# EAGLE design TUEV071 (EAGLE 7.5.0)
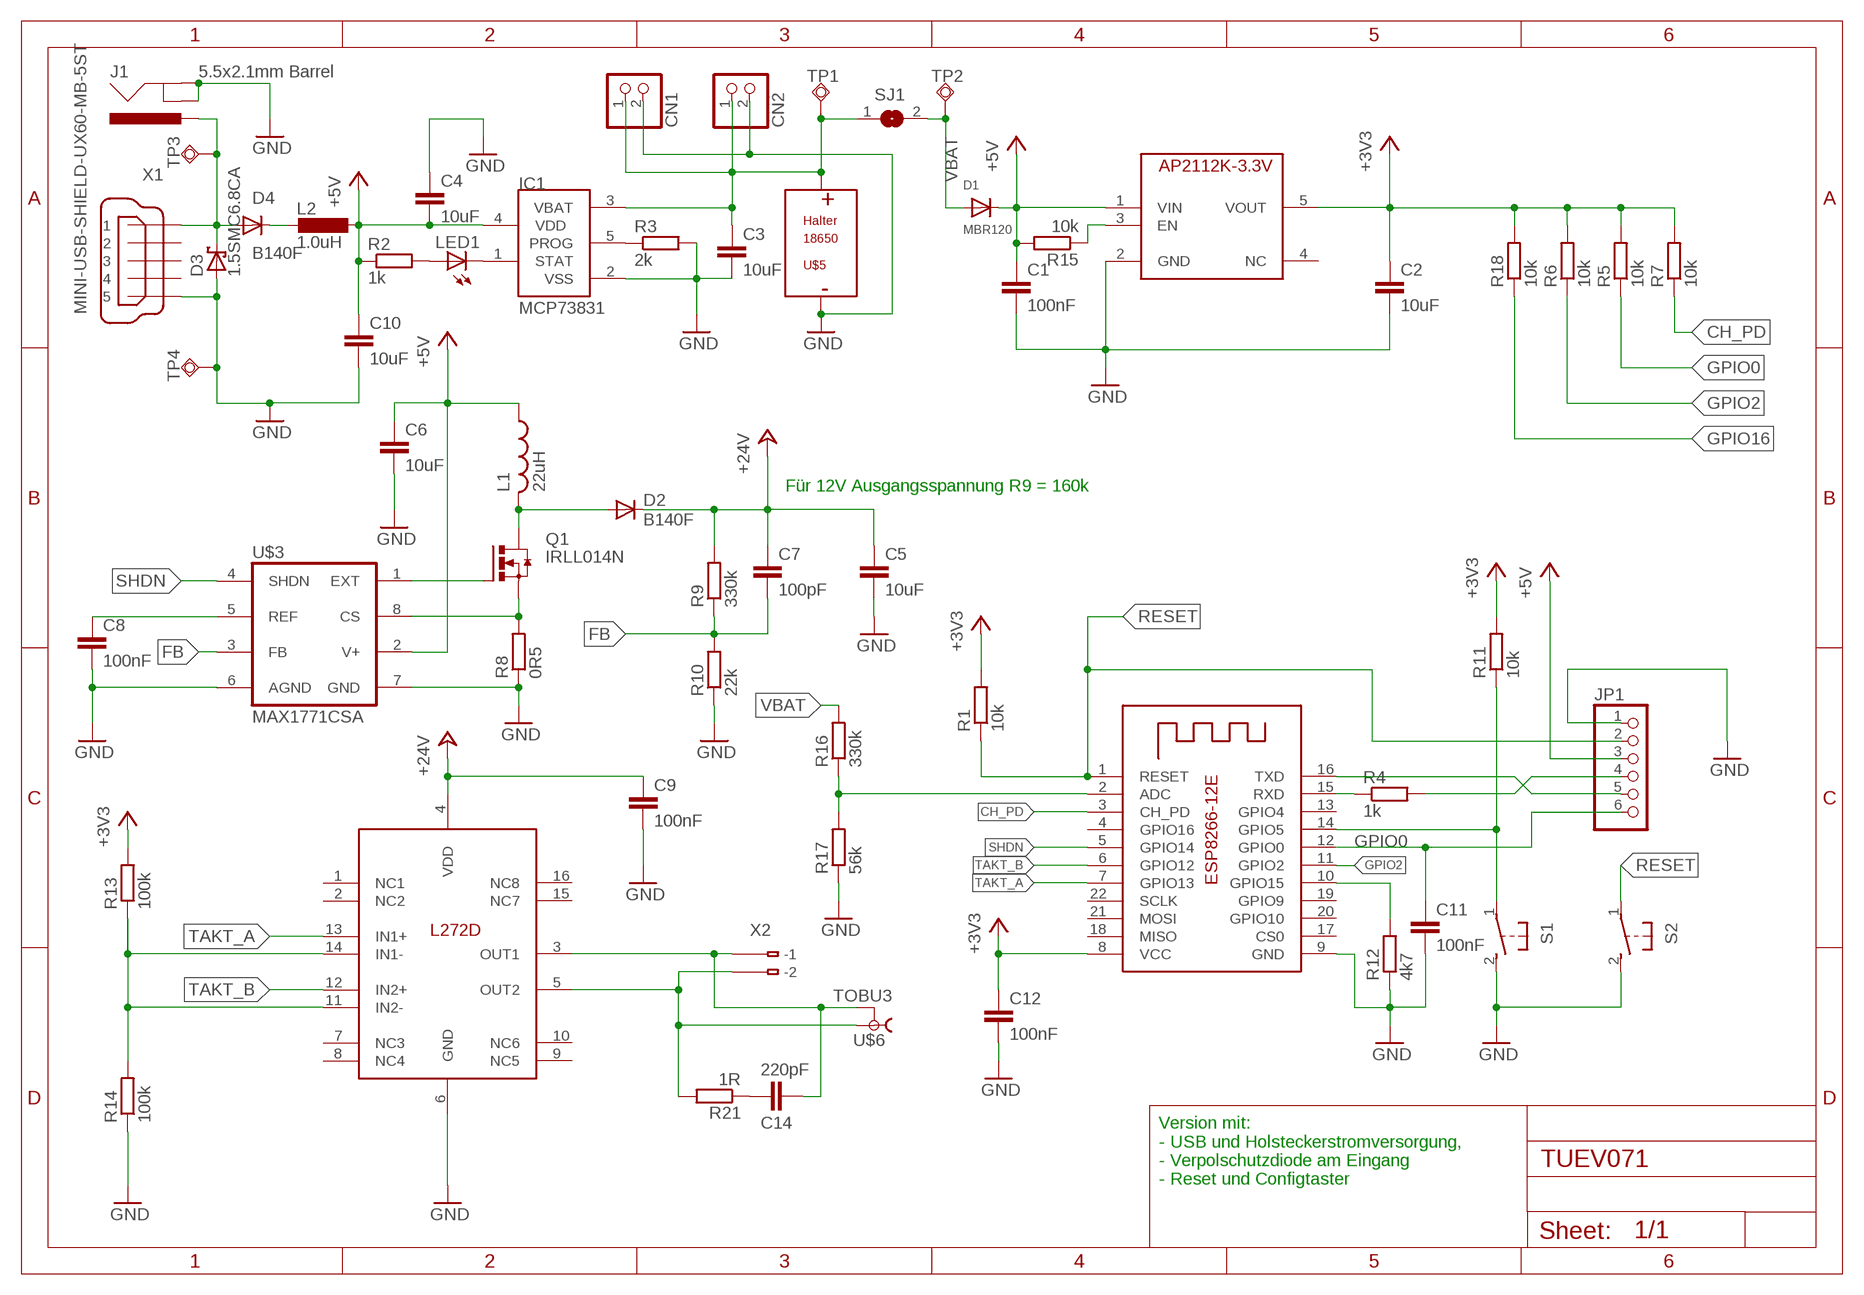
[diagram p0: schematic, sheet 1]

## Parts
C1  100nF  C-EUC0603K  [C0603K]
C2  10uF  C-EUC0603K  [C0603K]
C3  10uF  C-EUC0603K  [C0603K]
C4  10uF  C-EUC0603K  [C0603K]
C5  10uF  C-EUC1210K  [C1210K]
C6  10uF  C-EUC0603K  [C0603K]
C7  100pF  C-EUC0603K  [C0603K]
C8  100nF  C-EUC0603K  [C0603K]
C9  100nF  C-EUC0603K  [C0603K]
C10  10uF  C-EUC0603K  [C0603K]
C11  100nF  C-EUC0603K  [C0603K]
C12  100nF  C-EUC0603K  [C0603K]
C14  220pF  C-EUC0603K  [C0603K]
CN1  JST_2PIN-SMT-RA  [JST-PH-2-SMT-RA]
CN2  JST_2PIN-SMT-RA  [JST-PH-2-SMT-RA]
D1  MBR120  DIODESOD-123  [SOD-123]
D2  B140F  DIODE-DO214AC  [DO214AC]
D3  1.5SMC6.8CA  SCHOTTKY-DIODESMC  [SMC]
D4  B140F  DIODE-DO214AC  [DO214AC]
IC1  MCP73831  [SOT23-5L]
J1  5.5x2.1mm Barrel  POWER_JACKSMD  [POWER_JACK_SMD]
JP1  PINHD-1X6  [1X06]
L1  22uH  L-USL5650M  [L5650M]
L2  1.0uH  L-EUL3230M  [L3230M]
LED1  LEDCHIPLED_0805  [CHIPLED_0805]
Q1  IRLL014N  N-HEXFET-2D_SOT232-IRLL014N  [SOT223]
R1  10k  R-EU_M1206  [M1206]
R2  1k  R-EU_M1206  [M1206]
R3  2k  R-EU_M1206  [M1206]
R4  1k  R-EU_M1206  [M1206]
R5  10k  R-EU_M1206  [M1206]
R6  10k  R-EU_M1206  [M1206]
R7  10k  R-EU_M1206  [M1206]
R8  0R5  R-EU_R2512  [R2512]
R9  330k  R-EU_M1206  [M1206]
R10  22k  R-EU_M1206  [M1206]
R11  10k  R-EU_M1206  [M1206]
R12  4k7  R-EU_M1206  [M1206]
R13  100k  R-EU_M1206  [M1206]
R14  100k  R-EU_M1206  [M1206]
R15  10k  R-EU_M1206  [M1206]
R16  330k  R-EU_M1206  [M1206]
R17  56k  R-EU_M1206  [M1206]
R18  10k  R-EU_M1206  [M1206]
R21  1R  R-EU_M1206  [M1206]
S1  31-XX  [B3F-31XX]
S2  31-XX  [B3F-31XX]
SJ1  SJ  [SJ]
TP1  TPSQPAD1-13Y  [P1-13Y]
TP2  TPSQPAD1-13Y  [P1-13Y]
TP3  TPSQPAD1-13Y  [P1-13Y]
TP4  TPSQPAD1-13Y  [P1-13Y]
U$1  AP2112-3.3  [SOT23-5L]
U$2  L272D  [SO16]
U$3  MAX1771CSA  [SO08]
U$4  ESP-12E  [ESP-12E]
U$5  HA1X18650SMD  [HA1X18650SMD]
U$6  TOBU3  TOBU3-REICHELT  [TOBU3-REICHELT]
X1  MINI-USB-SHIELD-UX60-MB-5ST  [UX60-MB-5ST]
X2  233-102  [233-102]

## Nets
+3V3 [Power]: C2.1 C12.1 R1.2 R5.2 R6.2 R7.2 R11.2 R13.2 R18.2 U$1.5(VOUT) U$4.8(VCC)
+5V: C1.1 C4.2 C6.1 C10.1 D1.C IC1.4(VDD) JP1.3 L1.1 L2.1 R2.1 R15.2 U$1.1(VIN) U$3.2(V+)
+24V [Power]: C5.1 C7.1 C9.1 D2.C R9.2 U$2.4(VDD)
CH_PD: R7.1 U$4.3(CH_PD)
FB: C7.2 R9.1 R10.2 U$3.3(FB)
GND [Power]: C1.2 C2.2 C3.2 C4.1 C5.2 C6.2 C8.2 C9.2 C10.2 C11.2 C12.2 CN1.2 CN2.2 D3.A IC1.2(VSS) J1.GND(GNDBREAK) J1.P$4(GND) JP1.1 R3.2 R8.1 R10.1 R12.1 R14.1 R17.1 S1.2(S) S2.2(S) TP4.TP U$1.2(GND) U$2.6(GND) U$3.6(AGND) U$3.7(GND) U$4.9(GND) U$5.P$2- X1.5
GPIO0: C11.1 JP1.6 R5.1 U$4.12(GPIO0)
GPIO2: R6.1 U$4.11(GPIO2)
GPIO16: R18.1
N$1: JP1.5 U$4.16(TXD)
N$2: JP1.4 R4.2
N$3: R4.1 U$4.15(RXD)
N$4: IC1.1(STAT) LED1.C
N$5: LED1.A R2.2
N$6: IC1.5(PROG) R3.1
N$7: Q1.1(G) U$3.1(EXT)
N$8 [Power]: D4.C L2.2
N$9 [Power]: Q1.3(S) R8.2 U$3.8(CS)
N$10 [Power]: D2.A L1.2 Q1.2(D) Q1.4(D)
N$11 [Power]: C14.2 U$2.3(OUT1) U$6.2 U$6.2@1 U$6.2@2 X2.B1(B-1)
N$12: C8.1 U$3.5(REF)
N$13 [Power]: R21.2 U$2.5(OUT2) U$6.1 X2.B2(B-2)
N$14: R12.2 U$4.10(GPIO15)
N$15 [Power]: D3.C D4.A J1.VIN0(PWR) TP3.TP X1.1
N$16: R16.1 R17.2 U$4.2(ADC)
N$17: R15.1 U$1.3(EN)
N$21: C14.1 R21.1
N$23: R11.1 S1.1(P) U$4.14(GPIO5)
N$38: R13.1 R14.2 U$2.11(IN2-) U$2.14(IN1-)
RESET: JP1.2 R1.1 S2.1(P) U$4.1(RESET)
SHDN: U$3.4(SHDN) U$4.5(GPIO14)
TAKT_A: U$2.13(IN1+) U$4.7(GPIO13)
TAKT_B: U$2.12(IN2+) U$4.6(GPIO12)
VBAT [Power]: D1.A R16.2 SJ1.2 TP2.TP
VBAT1 [Power]: C3.1 CN1.1 CN2.1 IC1.3(VBAT) SJ1.1 TP1.TP U$5.P$1+
Unconnected: U$1.4(NC) U$2.1(NC1) U$2.2(NC2) U$2.7(NC3) U$2.8(NC4) U$2.9(NC5) U$2.10(NC6) U$2.15(NC7) U$2.16(NC8) U$4.4(GPIO16) U$4.13(GPIO4) U$4.17(CS0) U$4.18(MISO) U$4.19(GPIO9) U$4.20(GPIO10) U$4.21(MOSI) U$4.22(SCLK) X1.2 X1.3 X1.4 X1.M1(S1) X1.M2(S2) X1.M3(S3) X1.M4(S4) X2.A1(-1) X2.A2(-2)

## Notes on the sheet
- Für 12V Ausgangsspannung R9 = 160k
- Version mit:
  - USB und Holsteckerstromversorgung,
  - Verpolschutzdiode am Eingang
  - Reset und Configtaster

## Library data of the parts
C1-C12 C14 = rcl:C-EU: CAPACITOR, European symbol
CN1 CN2 = adafruit:JST_2PIN: JST 2-Pin Connectors of various flavors SMT-RA (S2B-PH-SM4) 4UConnector #17311 SMT (B2B-PH-SM4) THM-RA (S2B-PH) THM (B2B-PH)
D1 = adafruit:DIODE: Diode SMADIODE - SMA Surface Mount Package 20V 1A Schottky Diode Digikey: 641-1014-6-ND DO-1N4148 - Through Hole Small Current Diode SOD-123 20V 1 A (.5mV Vf) Schottky Diode - Digikey: MBRX120TPMSCT-ND SOD-323 10V 570mA (.38mV Vf, 3ns) Schottky Diode - Digikey: ZLLS410CT-ND SOD-523 30V 30mA Schottky Diode (RB751S-40TE61) - Digikey: RB751S-40TE61CT-ND SOT23-R/W - SOT23 Package (R = Solder Paste/Reflow Ovens, W = Hand-Soldering) BAT54Film 40V 300mA - Digikey: 497-7162-1-ND
D2 D4 = diode:DIODE-: DIODE
D3 = diode:SCHOTTKY-DIODE: Schottky Diode
IC1 = microchip-update-2:MCP73831: Miniature Single-Cell, Fully Integrated Li-Ion, Li-Polymer Charge Management Controllers
J1 = SparkFun-Connectors:POWER_JACK: Power Jack Connector This is the standard 5.5mm barrel jack for power. The PTH is the most common, proven, reliable, footprint. The Slot footprint only works if the mill layer is transmitted to the PCB fab house so be warned. Here are the connectors we sell at SparkFun: DC Barrel Power Jack/Connector <https://www.sparkfun.com/products/119> (PRT-00119) DC Barrel Power Jack/Connector (SMD) <https://www.sparkfun.com/products/12748> (PRT-12748) DC Barrel Jack Adapter - Breadboard Compatible <https://www.sparkfun.com/products/10811> (PRT-10811) It is used on this SparkFun product (and many, many others): SparkFun RedBoard - Programmed with Arduino <https://www.sparkfun.com/products/12757> (DEV-12757) Also, if you need a mating power supply or connector, please check these out: Wall Adapter Power Supply - 9VDC 650mA <https://www.sparkfun.com/products/298> (TOL-00298) DC Barrel Jack Adapter - Male <https://www.sparkfun.com/products/10287> (PRT-10287); PROD_ID: CONN-08106; SF_ID: PRT-12748
JP1 = adafruit:PINHD-1X6: PIN HEADER
L1 = resistor:L-US: INDUCTOR, American symbol
L2 = rcl:L-EU: INDUCTOR, European symbol
LED1 = led:LED: LED OSRAM: - CHIPLED LG R971, LG N971, LY N971, LG Q971, LY Q971, LO R971, LY R971 LH N974, LH R974 LS Q976, LO Q976, LY Q976 LO Q996 - Hyper CHIPLED LW Q18S LB Q993, LB Q99A, LB R99A - SideLED LS A670, LO A670, LY A670, LG A670, LP A670 LB A673, LV A673, LT A673, LW A673 LH A674 LY A675 LS A676, LA A676, LO A676, LY A676, LW A676 LS A679, LY A679, LG A679 - Hyper Micro SIDELED® LS Y876, LA Y876, LO Y876, LY Y876 LT Y87S - SmartLED LW L88C, LW L88S LB L89C, LB L89S, LG L890 LS L89K, LO L89K, LY L89K LS L896, LA L896, LO L896, LY L896 - TOPLED LS T670, LO T670, LY T670, LG T670, LP T670 LSG T670, LSP T670, LSY T670, LOP T670, LYG T670 LG T671, LOG T671, LSG T671 LB T673, LV T673, LT T673, LW T673 LH T674 LS T676, LA T676, LO T676, LY T676, LB T676, LH T676, LSB T676, LW T676 LB T67C, LV T67C, LT T67C, LS T67K, LO T67K, LY T67K, LW E67C LS E67B, LA E67B, LO E67B, LY E67B, LB E67C, LV E67C, LT E67C LW T67C LS T679, LY T679, LG T679 LS T770, LO T770, LY T770, LG T770, LP T770 LB T773, LV T773, LT T773, LW T773 LH T774 LS E675, LA E675, LY E675, LS T675 LS T776, LA T776, LO T776, LY T776, LB T776 LHGB T686 LT T68C, LB T68C - Hyper Mini TOPLED® LB M676 - Mini TOPLED Santana® LG M470 LS M47K, LO M47K, LY M47K Source: http://www.osram.convergy.de LUXEON: - LUMILED® LXK2-PW12-R00, LXK2-PW12-S00, LXK2-PW14-U00, LXK2-PW14-V00 LXK2-PM12-R00, LXK2-PM12-S00, LXK2-PM14-U00 LXK2-PE12-Q00, LXK2-PE12-R00, LXK2-PE12-S00, LXK2-PE14-T00, LXK2-PE14-U00 LXK2-PB12-K00, LXK2-PB12-L00, LXK2-PB12-M00, LXK2-PB14-N00, LXK2-PB14-P00, LXK2-PB14-Q00 LXK2-PR12-L00, LXK2-PR12-M00, LXK2-PR14-Q00, LXK2-PR14-R00 LXK2-PD12-Q00, LXK2-PD12-R00, LXK2-PD12-S00 LXK2-PH12-R00, LXK2-PH12-S00 LXK2-PL12-P00, LXK2-PL12-Q00, LXK2-PL12-R00 Source: www.luxeon.com KINGBRIGHT: KA-3528ASYC Source: www.kingbright.com
Q1 = transistor-power:N-HEXFET-2D_?-*: HEXFET® Power MOSFET 2 Drain connects http://www.irf.com/product-info/datasheets/data/irll014n.pdf
R1-R18 R21 = resistor:R-EU_: RESISTOR, European symbol
S1 S2 = switch-omron:31-XX: OMRON SWITCH; MPN: B3F-3100; OC_FARNELL: 959704; OC_NEWARK: 36M3582
SJ1 = jumper:SJ: SMD solder JUMPER
TP1-TP4 = testpad:TPSQ: Test pad
U$1 = adafruit:AP2112-3.3
U$2 = adafruit:L272D
U$3 = maxim:MAX1771CSA
U$4 = adafruit:ESP-12E: ESP8266-12E Variante
U$5 = MeineLIB:HA1X18650SMD
U$6 = con-hirschmann:TOBU3-REICHELT
X1 = con-hirose:MINI-USB-SHIELD-: MINI USB Connector Source: http://www.hirose.co.jp/cataloge_hp/e24000019.pdf; OC_FARNELL: unknown; OC_NEWARK: unknown
X2 = con-wago:233-102: WAGO Cage Clamp; MPN: 233-102; OC_FARNELL: unknown; OC_NEWARK: 28K9044

## Net classes
0 default: width 0.102 mm, drill 0.076 mm, clearance 0.051 mm
1 Power: width 1.016 mm, drill 0.076 mm, clearance 0.051 mm to class 0, clearance 0.051 mm
2 24V: width 0.127 mm, drill 0.076 mm, clearance 0.051 mm to class 0, clearance 0.051 mm to class 1, clearance 0.051 mm

## Board
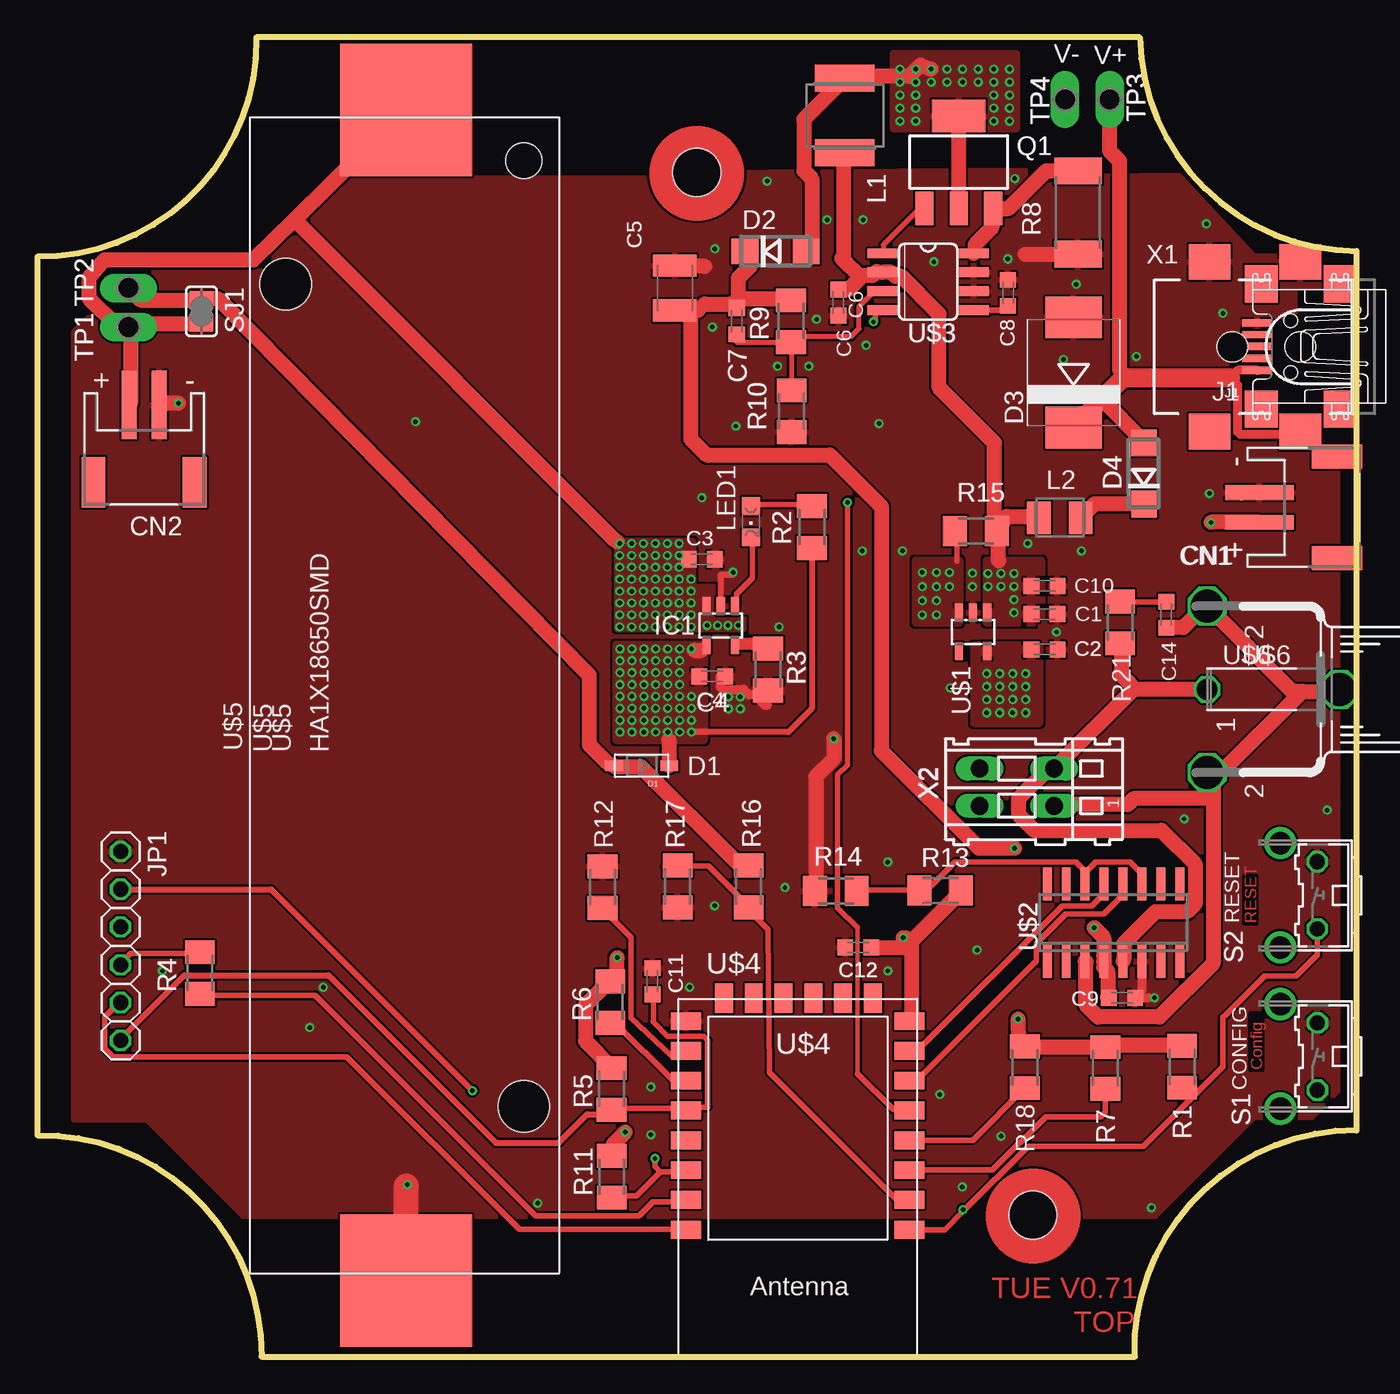
[diagram p1: board, top side]
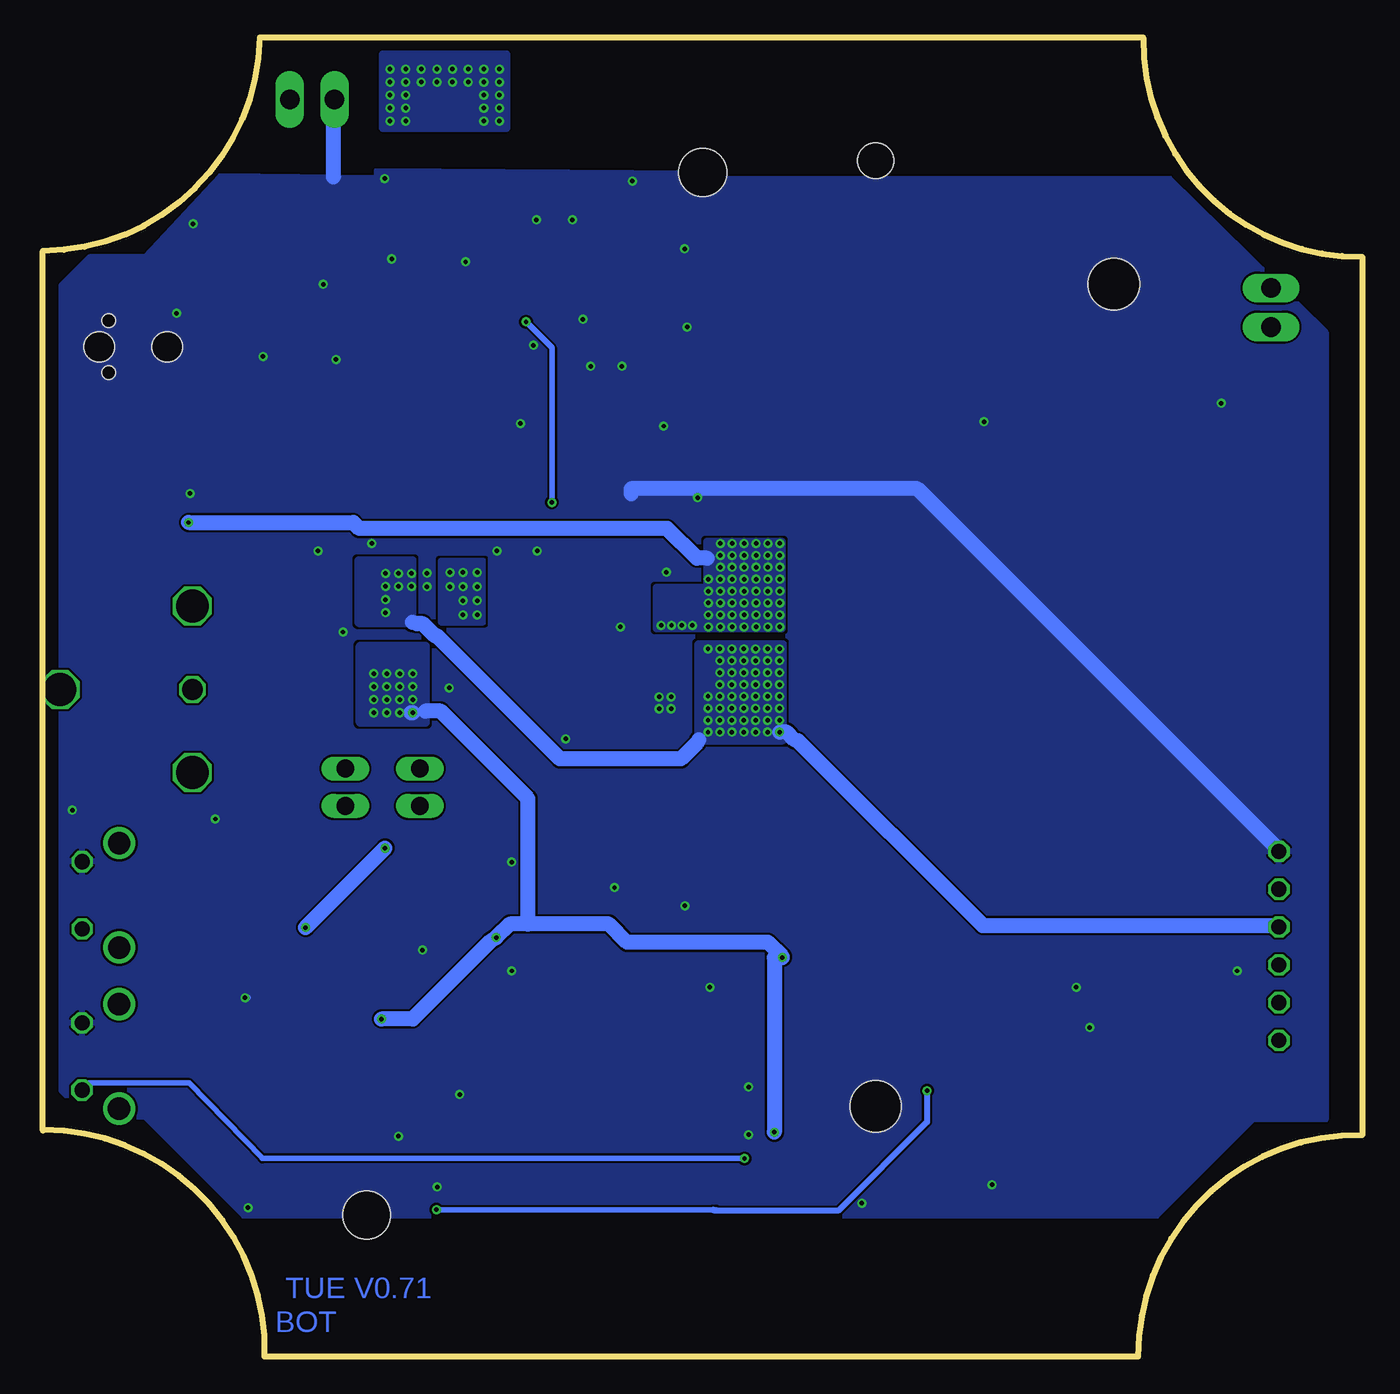
[diagram p2: board, bottom side, seen from below]

Size 88.58 x 88.58 mm. Coordinates in mm from the lower left corner, seen from the top.
Outline: 73.67,0 15.05,0 arc92 0,14.88 0,73.85 arc92 14.7,88.55
Outline: 73.67,0 73.7,0
Outline: 88.58,15.2 88.58,74.23 arc-89 74.02,88.58 14.7,88.58
Outline: 73.67,0 arc-92 88.55,15.22
Copper layers (1+16): Top 0.035mm / dielectric 0.36mm / Bottom 0.035mm
Design rules "PCB-Joker-Eagle-DRU-v1-0 3 *": minimum track width 15mil, minimum drill 0.3mm, track to track 6mil, track to pad 6mil, pad to pad 6mil, via to via 6mil, smd to smd 6mil, copper to edge 0mil, drill to drill 10mil, minimum pad ring 8mil, minimum via ring 6mil, stop-mask expansion 3mil, vias tented up to drill 0mil, thermal gap 6mil
Holes 3.2 mm at 44.27,79.51 66.85,9.51
tKeepout: area 42.2,-0.2 to 60.4,7.5
bKeepout: area 20.6,8.2 to 23.1,10.7; area 43,78.2 to 45.5,80.7; area 20.6,78.2 to 23.1,80.7; area 42.2,0 to 60.4,7.7; area 65.6,8.2 to 68.1,10.7

### Footprints (pad centres in the part's own frame; a part is rotated, then mirrored left to right if it is on the bottom)
C0603K = smd 1.05 x 1.08: 1 -0.875,0; 2 0.875,0
C1210K = smd 1.5 x 2.9: 1 -1.5,0; 2 1.5,0
JST-PH-2-SMT-RA = smd 1 x 4.6: 1 1,-3.7; 2 -1,-3.7 | smd 1.6 x 3.4: NC1 -3.4,1.5; NC2 3.4,1.5
SOD-123 = smd 1.2 x 0.7: A 1.85,0; C -1.85,0
DO214AC = smd 1.8 x 1.7: A 2.05,0; C -2.05,0
SMC = smd 2.8 x 3.8: A 3.7,0; C -3.7,0
SOT23-5L = smd 0.55 x 1.2: 1 -0.95,-1.3; 2 0,-1.3; 3 0.95,-1.3; 4 0.95,1.3; 5 -0.95,1.3
POWER_JACK_SMD = smd 2.8 x 2.4: GND 0,-5.7; P$4 6.1,-5.7; VIN0 0,5.7; VIN1 6.1,5.7 | hole 2.032: 0,0; 4.572,0
1X06 = drill 1.016 octagon: 1 -6.35,0; 2 -3.81,0; 3 -1.27,0; 4 1.27,0; 5 3.81,0; 6 6.35,0
L5650M = smd 1.8 x 4: 1 -2.5,0; 2 2.5,0
L3230M = smd 1.6 x 2.2: 1 -1.4,0; 2 1.4,0
CHIPLED_0805 = smd 1.2 x 1.2: A 0,-1.05; C 0,1.05
SOT223 = smd 1.219 x 2.235: 1 -2.311,-3.099; 2 0,-3.099; 3 2.311,-3.099 | smd 3.6 x 2.2: 4 0,3.099
M1206 = smd 1.6 x 2: 1 -1.4,0; 2 1.4,0
R2512 = smd 1.8 x 3.2: 1 -2.8,0; 2 2.8,0
B3F-31XX = drill 1.016 octagon: 1 -2.261,-1.245; 2 2.261,-1.245 | drill 1.499 pad 2.159: 3 -3.505,1.245; 4 3.505,1.245
SJ = smd 1.168 x 1.6: 1 -0.762,0; 2 0.762,0
P1-13Y = drill 1.321 pad 1.905 long: TP 0,0
SO16 = smd 0.6 x 2.2: 1 -4.445,-2.6; 2 -3.175,-2.6; 3 -1.905,-2.6; 4 -0.635,-2.6; 5 0.635,-2.6; 6 1.905,-2.6; 7 3.175,-2.6; 8 4.445,-2.6; 9 4.445,2.6; 10 3.175,2.6; 11 1.905,2.6; 12 0.635,2.6; 13 -0.635,2.6; 14 -1.905,2.6; 15 -3.175,2.6; 16 -4.445,2.6
SO08 = smd 0.66 x 2.032: 1 -1.905,-3.073; 2 -0.635,-3.073; 3 0.635,-3.073; 4 1.905,-3.073; 5 1.905,3.073; 6 0.635,3.073; 7 -0.635,3.073; 8 -1.905,3.073
ESP-12E = smd 2 x 1.2: 1 -7.5,7.04; 2 -7.5,5.04; 3 -7.5,3.04; 4 -7.5,1.04; 5 -7.5,-0.96; 6 -7.5,-2.96; 7 -7.5,-4.96; 8 -7.5,-6.96; 9 7.5,-6.96; 10 7.5,-4.96; 11 7.5,-2.96; 12 7.5,-0.96; 13 7.5,1.04; 14 7.5,3.04; 15 7.5,5.04; 16 7.5,7.04 | smd 1.2 x 2: 17 -5.04,-8.5; 18 -3.04,-8.5; 19 -1.04,-8.5; 20 0.96,-8.5; 21 2.96,-8.5; 22 4.96,-8.5
HA1X18650SMD = smd 8.89 x 8.89: P$1+ 77.4,10.06; P$2- -1.2,10.06 | hole 3.45: 10.5,2.16; 65.7,18.16 | hole 2.4: 74,2.16
TOBU3-REICHELT = drill 1.397 octagon: 1 0,-3.81 | drill 2.21 octagon: 2 5.588,-3.81; 2@1 -5.588,-3.81; 2@2 0,5.08
UX60-MB-5ST = smd 2 x 0.5: 1 2.25,1.6; 2 2.25,0.8; 3 2.25,0; 4 2.25,-0.8; 5 2.25,-1.6 | smd 2.2 x 2.5: M1 -3.3,-4.2; M2 -3.3,4.2; M3 2,4.2; M4 2,-4.2 | hole 0.9: 0,-1.75; 0,1.75
233-102 = drill 1.2 long: A1 -1.25,2.5; A2 1.25,2.5; B1 -1.25,-2.5; B2 1.25,-2.5

### Placement (x,y rotation side)
C1  67.62,49.85 0 top
C2  67.62,47.48 0 top
C3  44.62,53.53 0 top
C4  45.33,45.67 180 top
C5  42.8,71.75 90 top
C6  53.78,70.76 270 top
C7  46.96,69.52 270 top
C8  65.17,71.42 90 top
C9  72.82,24.09 0 top
C10  67.62,51.75 0 top
C11  41.3,25.2 90 top
C12  55.12,27.48 180 top
C14  75.8,49.8 270 top
CN1  85.76,57.02 270 top
CN2  7.17,60.2 180 top
D1  40.59,39.68 180 top
D2  49.58,74.2 0 top
D3  69.58,66.08 90 top
D4  74.3,59.3 90 top
IC1  45.88,49.09 180 top
J1  84.8,67.8 180 top
JP1  5.59,27.57 270 top
L1  54.22,83.33 90 top
L2  68.65,56.33 0 top
LED1  47.91,56.06 180 top
Q1  61.87,80.2 0 top
R1  76.86,19.47 90 top
R2  52.01,55.7 90 top
R3  49.06,46.13 270 top
R4  10.92,25.76 90 top
R5  38.55,17.98 90 top
R6  38.47,23.8 90 top
R7  71.72,19.38 90 top
R8  69.87,76.81 90 top
R9  50.6,69.52 90 top
R10  50.65,63.48 90 top
R11  38.57,12.08 90 top
R12  37.95,31.52 270 top
R13  60.62,31.3 0 top
R14  53.62,31.27 0 top
R15  63.02,55.44 0 top
R16  47.77,31.57 90 top
R17  43,31.57 90 top
R18  66.31,19.43 90 top
R21  72.7,49.3 270 top
S1  84.7,20.16 90 top
S2  84.7,30.98 90 top
SJ1  11.03,70.17 90 top
TP1  6.12,69.12 90 top
TP2  6.12,71.75 90 top
TP3  72,84.4 0 top
TP4  69,84.4 0 top
U$1  62.83,48.66 180 top
U$2  72.25,29.14 0 top
U$3  59.81,72.17 270 top
U$4  51.06,15.57 180 top
U$5  34.83,6.3 90 top
U$6  82.35,44.8 270 top
X1  84.17,67.82 180 top
X2  65.77,38.23 90 top

### Tracks (layer width: path | path; a pad name or v marks a point on that pad's centre or on a via)
+3V3  (via drill 0.3)
  Top 1.016: R5.2 38.54,19.47 36.8,21.2 36.8,23.6 38.41,25.2 R6.2 38.67,25.6 38.94,25.87 v38.94,26.8 | 58.67,27.87 58.67,27.48 | 58.67,27.48 58.67,22.54 U$4.8 | 58.67,27.87 62.01,31.2 R13.2 | v39.47,15.07 38.67,14.27 38.67,13.6 R11.2 | v58.14,28.14 58.27,28.14 58.67,27.87 | v65.85,22.67 65.88,21.07 R18.2 66.81,20.8 71.61,20.8 R7.2 72.14,20.94 76.81,20.94 R1.2 | C12.1 58.67,27.48
  Bottom 1.016: v39.47,15.07 39.47,26.8 v38.94,26.8 38.94,26.86 39.9,27.82 49.35,27.82 50.58,29.05 56.01,29.05 | v65.85,22.67 63.74,22.67 58.54,27.87 v58.14,28.14 57.23,29.05 56.01,29.05 | v63.74,43.23 63.88,43.23 | 62.9,43.34 61.87,43.34 56.01,37.47 56.01,29.05
  other vias: 64.62,45.86 65.49,45.86 66.37,45.86 64.62,44.98 63.74,44.98 65.49,44.98 66.37,44.98 65.49,44.11 64.62,44.11 63.74,44.11 64.62,43.23 65.49,43.23 66.37,43.23 66.37,44.11 63.74,45.86
  pour Top (rank 2): 62.9,47.7 62.9,42.59 67.27,42.59 67.27,47.7
  pour Bottom: 62.9,47.7 62.9,42.59 67.27,42.59 67.27,47.7
+5V  (via drill 0.3)
  Top 0.381: 44.57,47.42 IC1.4
  Top 0.406: R2.1 52,43.5 50.42,41.92 v43.92,41.92
  Top 1.016: 55.29,72.46 55.41,72.58 56.08,72.58 56.34,72.85 U$3.2 57.21,72.81 57.34,72.81 57.61,72.54 58.01,72.54 60.54,70.01 60.54,65.08 64.28,61.34 64.28,55.87 R15.2 | 55.29,72.46 54.47,71.65 53.81,71.65 C6.1 | 54.01,73.74 55.29,72.46 | 54.01,73.74 54.14,73.88 54.14,80.81 L1.1 | 54.31,73.48 54.01,73.74 | 44.12,47.42 44.57,47.42 | 64.54,53.42 64.54,55.34 R15.2 | 42.41,41.4 42.41,39.74 D1.C | 64.67,56.14 R15.2 | L2.1 67.21,56.41 65.08,56.41 R15.2
  Bottom 1.016: JP1.3 5.6,28.94 25.47,28.94 37.87,41.34 38.12,41.4 38.64,41.92 v39.12,41.92 | 63.78,49.29 63.48,49.21 63.08,49.21 62.27,48.41 62.14,48.41 53.87,40.14 45.74,40.14 44.67,41.2 44.55,41.4
  other vias: 42.33,47.52 65.58,49.96 65.58,50.83 63.84,51.71 65.58,51.71 63.84,52.58 65.58,52.58 64.71,51.71 64.71,52.58 43.12,47.52 43.92,47.52 43.12,46.73 42.33,46.73 41.52,47.52 41.52,46.73 41.52,45.92 42.33,45.92 43.12,45.92 43.12,45.12 42.33,45.12 41.52,45.12 41.52,44.33 42.33,44.33 43.12,44.33 43.92,44.33 43.92,43.52 43.12,43.52 42.33,43.52 41.52,43.52 41.52,42.73 42.33,42.73 43.12,42.73 43.92,42.73 43.12,41.92 42.33,41.92 41.52,41.92 40.73,47.52 40.73,46.73 40.73,45.92 39.92,45.92 39.92,46.73 39.92,47.52 39.12,47.52 39.12,46.73 39.12,45.92 40.73,45.12 39.92,45.12 39.12,45.12 39.12,44.33 39.92,44.33 40.73,44.33 40.73,43.52 39.92,43.52 39.12,43.52 40.73,42.73 39.92,42.73 39.12,42.73 39.92,41.92 40.73,41.92
  pour Top (rank 5): 38.91,47.78 44.73,47.78 44.73,41.4 38.91,41.4
  pour Top: 63.78,49.29 63.78,53.42 67.37,53.42 67.37,49.29
  pour Bottom: 63.78,49.29 63.78,53.42 67.37,53.42 67.37,49.29
  pour Bottom (rank 5): 38.91,47.78 44.55,47.78 44.55,41.4 38.91,41.4
+24V  (via drill 0.3)
  Top 1.016: C7.1 47.01,70.98 50.47,70.98 R9.2 | D2.C 47.87,74.14 47.87,73.21 47.07,72.41 47.07,71.48 C7.1 | C7.1 46.54,70.67 44.81,70.67 44.38,70.25 C5.1 43.87,69.74 43.87,61.61 44.94,60.54 53.21,60.54 56.67,57.07 56.67,40.67 63.21,34.14 v65.61,34.14 | C9.1 71.88,24.14 71.88,25.87 71.61,26.14 U$2.4 71.61,26.94 71.61,28.14 v70.94,28.8
  Bottom 1.016: v65.61,34.14 v70.94,28.8
CH_PD
  Top 0.381: U$4.3 58.67,12.54 64.14,12.54 67.71,16.1 71.4,16.1 71.72,16.42 R7.1
FB
  Top 0.35: C7.2 46.97,68.09 50.49,68.09 R9.1 | 50.74,68.21 R9.1 | R10.2 50.65,64.98 50.65,68 R9.1 | U$3.3 56.68,71.52 56.18,71.52 55.17,70.51 55.17,69 54.67,68.5 51.15,68.5 50.9,68.25 R9.1
GND  (via drill 0.3)
  Top 0.406: 74.16,24.55 C9.2 | 74.59,24.09 v75,24.1 | IC1.2 45.9,50.39 45.9,52.5 46.73,52.5 v46.73,52.67
  Top 0.61: 49,43.75 48.83,43.75 48.12,44.45 47.77,44.45 47.42,44.8 46.02,44.8 45.85,44.98 45.85,45.68 | 80.85,57.75 81.12,58.02 CN1.2 | U$2.6 74.16,24.55 | C9.2 74.59,24.09
  Top 1.016: C3.2 45.46,53.51 45.57,53.53 | 44.8,73.21 42.69,73.21 C5.2 | 66.33,74.01 69.74,74.01 R8.1 | 5.6,34 JP1.1 | 8.27,63.88 CN2.2 8.67,64.01 v9.47,64.01 | 37.47,33.07 R12.1 | v53.47,41.47 53.47,40.14 52.27,38.94 52.27,31.34 R14.1 | 24.77,11.46 24.8,11.47 v24.85,11.55
  Top 1.676: U$5.P$2- 24.77,11.46
  Bottom 0.406: v75,24.1 74.8,24.1
  Bottom 1.016: 49.08,57.94 49.07,58.14 49.07,58.27 29.87,58.27 5.6,34 JP1.1 | TP4.TP 69.08,84.28 69.08,79.34 69.08,79.19
  other vias: 46.9,62.48 51.8,66.5 49.7,66.5 52.33,69.65 45.5,74.38 49,78.92 53.02,76.33 55.45,76.33 60.2,73.5 65.15,73.7 65.62,79.1 79.6,70.05 55.65,67.9 45.33,69.12 46.4,44.3 56.52,62.65 44.62,57.67 68.42,48.65 45.48,30.27 62.1,11.4 64.7,14.8 74.8,10 86.6,36.7 77,36.1 70.1,54.1 66.5,54.6 58.1,54.1 55.4,54.1 61.3,44.9 57.1,33.2 50.2,31.5 41.2,18.1 19.2,24.8 8.4,25.9 62.8,51.7 62.8,52.6 60.6,17.6 57.1,25.9 43.8,24.8 41.2,14.9 33.6,10.3 18.3,22.1 63.1,27.3 25.4,62.77 73.8,67.15 68.9,66.95 78.5,76.05 78.7,57.95 49.8,49 47.2,44.3 47.2,43.5 46.4,43.5 69.75,72
  pour Top: 45.57,57.87 45.57,52.58 47.27,52.58 47.27,57.87
  pour Bottom (rank 6): 45.53,57.87 45.88,41.52 54.61,41.17
  pour Bottom (rank 3): 66.15,61.95 66.15,79.62 44.62,79.45 44.8,61.77
  pour Top: 45.85,41.12 45.85,45.85 51.27,45.85 51.27,41.12
  pour Top (rank 2): 66.33,62.12 66.33,79.62 44.8,79.45 44.8,61.95
  pour Bottom (rank 6): 2.45,15.93 7.35,15.93 13.82,9.45 75.08,9.45 81.72,16.1 85.58,16.1 87.33,17.85 87.33,71.92 85.4,73.85 81.72,73.85 76.65,79.28 60.73,79.1 12.95,79.1 2.45,68.78
  pour Top (rank 6): 2.45,15.93 7.35,15.93 13.82,9.45 75.08,9.45 81.72,16.1 85.58,16.1 87.33,17.85 87.33,71.92 85.4,73.85 81.72,73.85 76.65,79.28 60.73,79.1 12.95,79.1 2.45,68.78
GPIO0
  Top 0.381: 43.47,16.54 U$4.12 | 38.67,16.54 R5.1 | U$4.12 43.34,16.67 38.8,16.67 R5.1 | 9.87,25.6 5.6,21.34 JP1.6 | 38.41,16.67 R5.1 | C11.1 41.38,24.25 41.38,22.5 41.33,22.5 42.33,21.5 44.75,21.5 45,21.25 45,16.75 43.5,16.75 U$4.12
  Top 0.406: 9.87,25.6 19.55,25.6 30.8,14.35 35,14.35 36.92,16.27 38.25,16.27 R5.1
GPIO2
  Top 0.381: U$4.11 43.47,18.54 42.67,18.54 38.8,22.4 38.54,22.4 R6.1
GPIO16
  Top 0.381: 58.67,14.54 62.81,14.54 66.28,18 R18.1 66.41,18.14
N$1
  Top 0.381: U$4.16 43.47,8.53 32.38,8.53 20.78,20.14 5.07,20.14 4.53,20.67 4.53,22.8 5.47,23.74 JP1.5
N$2
  Top 0.381: R4.2 10.8,27.07 6.27,27.07 5.6,26.4 JP1.4
N$3
  Top 0.381: U$4.15 43.47,10.4 41.34,10.4 40.41,9.47 33.47,9.47 18.67,24.27 10.94,24.27 R4.1
N$4
  Top 0.381: IC1.1 46.94,50.41 46.94,51.21 48.01,52.27 48.01,54.94 LED1.C
N$5
  Top 0.381: LED1.A 48.01,57.21 51.87,57.21 R2.2
N$6
  Top 0.35: 46.89,47.82 IC1.5 46.97,47.85 | 48.22,47.85 R3.1
  Top 0.813: 48.22,47.85 46.97,47.85
N$7
  Top 0.35: U$3.1 56.8,74.15 56.8,74.66 59.19,77.04 59.44,77.04 Q1.1
N$8
  Top 1.016: D4.C 70.97,57.25 L2.2
N$9
  Top 1.016: U$3.8 62.96,74.15 62.96,74.66 64.09,75.79 64.09,76.04 64.22,76.16 64.22,77.04 Q1.3 64.67,77.08 65.21,77.08 67.74,79.61 69.74,79.61 R8.2
N$10  (via drill 0.3, 0.3 pad 0.25)
  Top 1.016: Q1.2 61.83,77.17 61.83,83.07 Q1.4 | v60.02,86.45 59.32,86.71 58.56,85.96 54.67,85.96 L1.2 53.87,85.48 51.47,83.08 51.47,79.61 52.01,79.08 52.01,74.28 D2.A
  other vias: 61.08,86.45 57.92,86.45 57.92,85.58 58.98,85.58 60.02,85.58 61.08,85.58 63.17,85.58 64.22,85.58 65.28,85.58 65.28,86.45 64.22,86.45 63.17,86.45 62.12,86.45 65.28,84.7 65.28,83.83 58.98,83.83 58.98,84.7 57.92,83.83 57.92,84.7 58.98,86.45 62.12,85.58 65.28,82.95 58.98,82.95 57.92,82.95 64.22,84.7 64.22,83.83 64.22,82.95
  pour Top: 57.42,82.42 65.79,82.42 65.79,87.5 57.42,87.5
  pour Bottom: 57.42,82.42 65.79,82.42 65.79,87.5 57.42,87.5
N$11
  Top 1.016: 78.94,37.47 78.94,38.8 U$6.2 79.34,39.07 84.94,44.67 | 78.94,37.47 78.94,26.4 75.34,22.8 71.21,22.8 70.41,23.6 70.41,26.54 U$2.3 | 78.94,37.47 73.61,37.47 73.21,37.07 68.28,37.07 X2.B1 | 84.94,44.67 87.34,44.67 U$6.2@2 | 84.94,44.67 84.26,44.67 U$6.2@1 78.14,50.14 76.94,48.94 75.88,48.94 C14.2
N$12
  Top 0.381: C8.1 64.81,70.28 62.94,70.28 U$3.5
N$13
  Top 1.016: U$2.5 72.94,26.67 72.94,27.74 75.08,29.87 77.21,29.87 77.74,30.4 77.74,33.07 75.48,35.34 66.94,35.34 65.88,36.41 65.88,37.47 67.88,39.47 68.14,39.47 X2.B2 73.59,44.8 | U$6.1 73.59,44.8 | R21.2 72.81,47.87 72.81,45.74 73.34,45.21 73.59,44.8
N$14
  Top 0.381: U$4.10 42.6,20.19 39.87,22.74 39.87,28.14 38.01,30 R12.2
N$15
  Top 0.61: X1.1 80.62,66.22 80.1,65.7 80.6,65.2 80.6,62.1 80.79,61.91 83.88,61.91
  Top 1.016: 69.61,62.27 D3.C | 83.88,61.91 84.68,62.01 J1.VIN0 | 71.47,64.28 74.28,61.47 D4.A | TP3.TP 72.01,84.28 72.01,80.94 72.68,80.28 72.68,66.28 72.9,65.7
  Top 1.27: 80.1,65.7 72.9,65.7 71.47,64.28 D3.C
N$16
  Top 0.381: R17.2 42.14,32.94 45.07,32.94 47.74,30.27 R16.1 47.74,30 49.07,28.67 49.15,19.09 57.65,10.59 57.78,10.77 58.54,10.54 U$4.2
N$17  (via drill 0.3)
  Top 0.381: 61.74,53.42 61.74,55.34 R15.1
  other vias: 61.25,51.7 60.38,51.7 60.38,52.65 59.42,52.65 59.42,51.7 59.42,50.75 60.38,50.75 60.38,49.8 59.42,49.8 61.25,52.65
  pour Top: 61.87,53.42 61.87,49.29 59.02,49.29 59.02,53.42
  pour Bottom: 61.87,53.42 61.87,49.29 59.02,49.29 59.02,53.42
N$21
  Top 0.381: C14.1 75.74,50.67 72.81,50.67 R21.1
N$23  (via drill 0.3)
  Top 0.381: R11.1 38.67,10.8 40.24,10.8 41.84,12.4 43.47,12.4 U$4.14 43.46,12.43 41.83,12.43 41.48,12.78 v41.48,13.3
  Bottom 0.381: 73.85,13.3 73.84,13.31 | 73.84,13.31 78.75,18.38 85.48,18.38 S1.1 | v41.48,13.3 v41.49,13.31 73.84,13.31
N$38
  Top 0.381: U$2.11 74.14,31.87 74.14,32.4 73.34,33.2 71.08,33.2 70.41,32.54 70.41,31.87 U$2.14 70.28,32.67 69.74,33.2 61.61,33.2 59.87,31.47 59.34,31.47 R13.1 59.21,31.34 55.07,31.34 R14.2
RESET  (via drill 0.3)
  Top 0.381: U$4.1 60.94,8.53 62.15,9.74 | 62.15,9.74 66.54,14.13 74.28,14.13 77.82,17.68 | v62.15,9.87 62.15,9.74 | S2.1 85.94,26.97 84.53,25.55 82.42,25.55 79.74,22.87 79.61,22.8 79.61,19.47 77.82,17.68 | 77.82,17.68 77.53,17.68 77.13,18.07 R1.1
  Top 0.406: JP1.2 15.69,31.39 v29.23,17.85
  Bottom 0.381: v62.15,9.87 43.58,9.87 43.37,9.87
  Bottom 0.406: v29.23,17.85 29.23,15.75 35.17,9.8 43.51,9.8 43.58,9.87
SHDN  (via drill 0.3)
  Top 0.305: 55.07,28.8 55.07,18.99
  Top 0.381: 55.07,18.99 57.47,16.59 57.61,16.59 58.54,16.54 U$4.5 | 55.07,28.8 53.74,30.14 53.74,39.07 54.41,39.74 v54.41,57.36 | v56.14,69.47 56.27,69.61 56.27,70.01 56.41,70.14 56.67,70.14 U$3.4
  Bottom 0.381: v54.41,57.36 54.41,67.74 v56.14,69.47
TAKT_A
  Top 0.381: U$4.7 58.67,20.54 59.07,20.54 68.81,30.27 70.81,30.27 71.61,31.07 U$2.13
TAKT_B
  Top 0.381: U$4.6 58.67,18.19 67.08,26.59 67.08,27.74 69.08,29.74 71.61,29.74 72.81,30.94 72.81,31.74 U$2.12
VBAT
  Top 1.016: TP2.TP 6.13,71.74 6.93,70.94 10.94,70.94 SJ1.2 11.47,71.03 12.13,71.03 37.07,45.74 37.07,41.07 38.27,39.87 D1.A 38.8,39.6 40.54,39.6 47.07,33.07 47.74,33.07 R16.2
VBAT1  (via drill 0.3)
  Top 1.016: SJ1.1 10.94,69.34 6.27,69.34 6.13,69.21 TP1.TP | CN2.1 6.27,64.01 6.27,68.67 TP1.TP | 17.27,76.34 24.67,83.61 U$5.P$1+ | 17.27,76.34 14.5,73.62 4.5,73.62 3.47,72.41 3.47,71.08 5.33,69.21 5.6,69.21 TP1.TP | 38.96,54.72 38.8,54.81 17.6,76.01 17.27,76.34 | CN1.1 78.82,56.02 v78.8,56
  Bottom 1.016: 43.98,53.61 44.67,53.61 46.67,55.61 67.34,55.61 67.73,56 v78.8,56
  other vias: 43.9,49 44.98,49.1 45.67,49.1 46.38,49.1 47.08,49.1 43.1,49 42.3,49 41.5,49 42.3,49.8 43.1,49.8 43.9,49.8 43.9,50.6 43.1,50.6 42.3,50.6 41.5,49.8 41.5,50.6 43.9,51.4 43.1,51.4 42.3,51.4 41.5,51.4 43.9,52.2 43.1,52.2 42.3,52.2 41.5,52.2 40.7,51.4 40.7,52.2 40.7,50.6 40.7,49.8 40.7,49 39.9,49 39.9,49.8 39.9,50.6 39.9,51.4 39.9,52.2 39.1,52.2 39.1,51.4 39.1,50.6 39.1,49.8 39.1,49 41.5,53 40.7,53 39.9,53 39.1,53 39.1,53.8 39.9,53.8 40.7,53.8 41.5,53.8 42.3,53.8 42.3,53 43.1,53 43.1,53.8 43.1,54.6 42.3,54.6 41.5,54.6 40.7,54.6 39.9,54.6 39.1,54.6
  pour Bottom: 43.98,54.72 43.98,51.63 47.38,51.63 47.38,48.88 38.96,48.88 38.96,54.72
  pour Top (rank 5, no thermals): 43.98,54.72 43.98,51.63 47.38,51.63 47.38,48.88 38.96,48.88 38.96,54.72
(copper drawn outside any net)
  shapes: Top circle x2

### Text on the board
Top: RESET | Config | TUE V0.71 | TOP
Bottom: TUE V0.71 | BOT
_tPlace: U$5 | U$5
_tNames: V- | V+ | TP4 | TP3 | Q1 | L1 | D2 | R8 | C5 | X1 | TP2 | TP2 | SJ1 | C6 | C7 | R9 | U$3 | U$3 | C8 | TP1 | TP1 | J1 | D3 | R10 | LED1 | - | L2 | D4 | R2 | R15 | CN2 | C3 | + | CN1 | C10 | IC1 | C1 | C2 | U$1 | U$1 | U$6 | R3 | C4 | D1 | R12 | X2 | JP1 | R17 | R16 | R14 | R13 | RESET | U$4 | U$2 | U$2 | C12 | S2 | R4 | C11 | C9 | R6 | R6 | CONFIG | R5 | R5 | S1 | R1 | R18 | R7 | R11 | R11
200bmp: /Users/michl/Desktop/ei500.bmp